# Altium schematic sheet Channel.SchDoc
size A
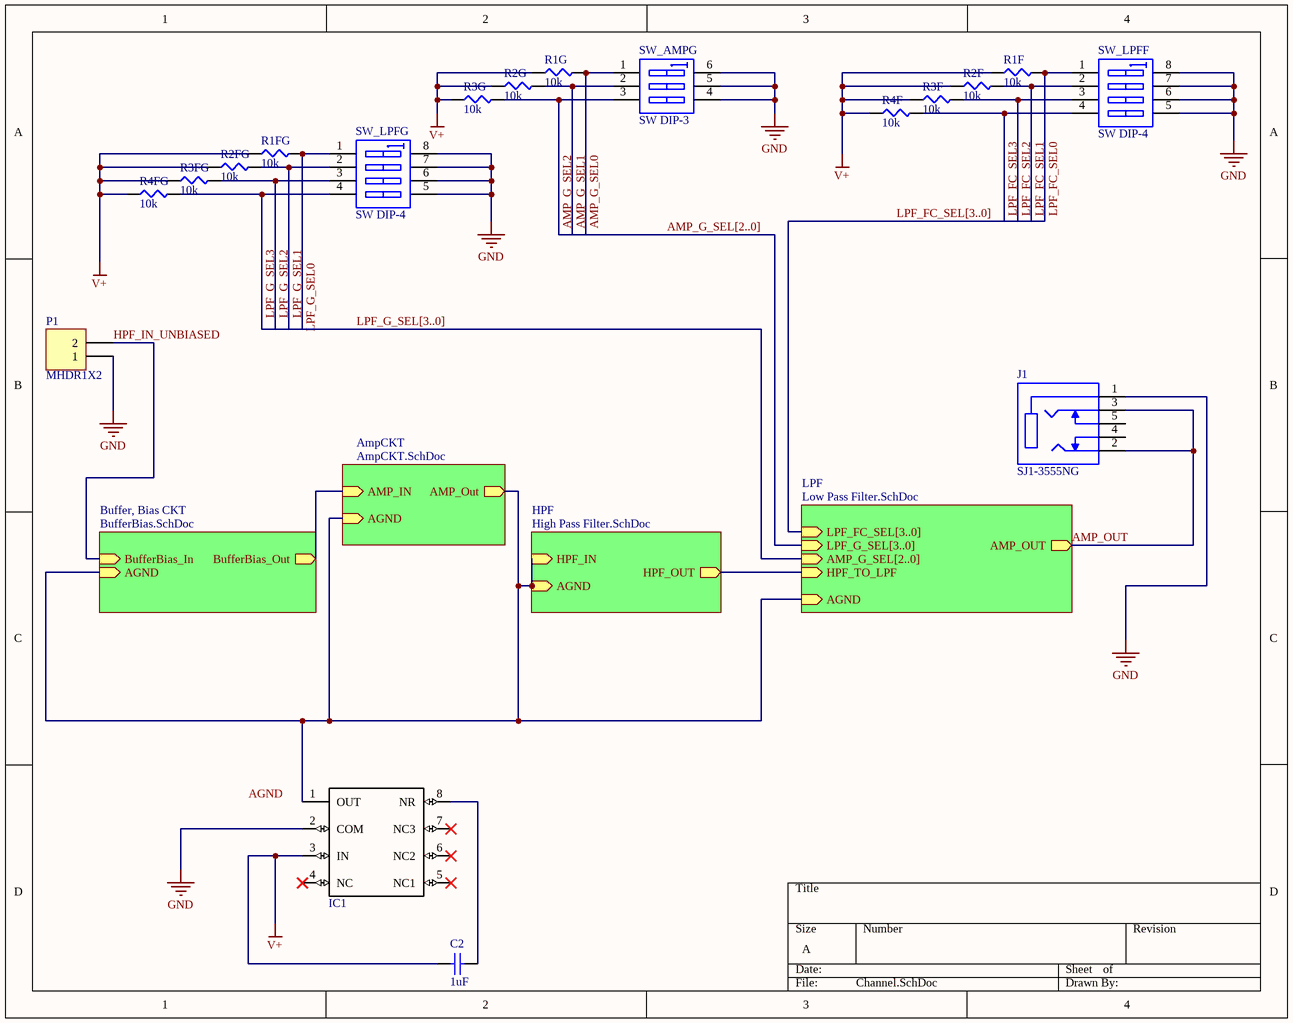
[diagram p0: Channel.SchDoc]

## Parts
C2  value 1uF  [SMD-0805C]  (hidden comment: Cap)
IC1  TLE2426  [SO8_M]  (value not drawn)
J1  SJ1-3555NG  [CUI_SJ1-3555NG]
P1  MHDR1X2  [MHDR1X2]
R1F  10k  [SMD-0805-RES]
R1FG  10k  [SMD-0805-RES]
R1G  10k  [SMD-0805-RES]
R2F  10k  [SMD-0805-RES]
R2FG  10k  [SMD-0805-RES]
R2G  10k  [SMD-0805-RES]
R3F  10k  [SMD-0805-RES]
R3FG  10k  [SMD-0805-RES]
R3G  10k  [SMD-0805-RES]
R4F  10k  [SMD-0805-RES]
R4FG  10k  [SMD-0805-RES]
SW_AMPG  SW DIP-3  [DIP-6]
SW_LPFF  SW DIP-4  [SO8_L]
SW_LPFG  SW DIP-4  [SO8_L]

## Sub-sheets
AmpCKT = AmpCKT.SchDoc: AMP_IN (in), AGND (in), AMP_Out (out)
Buffer, Bias CKT = BufferBias.SchDoc: BufferBias_In (in), AGND (in), BufferBias_Out (out)
HPF = High Pass Filter.SchDoc: HPF_IN (in), AGND (in), HPF_OUT (out)
LPF = Low Pass Filter.SchDoc: LPF_FC_SEL[3..0] (in), LPF_G_SEL[3..0] (in), AMP_G_SEL[2..0] (in), HPF_TO_LPF (in), AMP_OUT (out), AGND (in)

## Nets
GND: IC1.2(COM) J1.1 P1.1 SW_AMPG.4(B3) SW_AMPG.5(B2) SW_AMPG.6(B1) SW_LPFF.5(B4) SW_LPFF.6(B3) SW_LPFF.7(B2) SW_LPFF.8(B1) SW_LPFG.5(B4) SW_LPFG.6(B3) SW_LPFG.7(B2) SW_LPFG.8(B1)
V+: C2.2 IC1.3(IN) R1F.1 R1FG.1 R1G.1 R2F.1 R2FG.1 R2G.1 R3F.1 R3FG.1 R3G.1 R4F.1 R4FG.1
AMP_G_SEL0: R1G.2 SW_AMPG.1(A1)
AMP_G_SEL1: R2G.2 SW_AMPG.2(A2)
AMP_G_SEL2: R3G.2 SW_AMPG.3(A3)
AMP_OUT: J1.2 J1.3 ; sheet LPF/AMP_OUT
HPF_IN_UNBIASED: P1.2 ; sheet Buffer, Bias CKT/BufferBias_In
LPF_FC_SEL0: R1F.2 SW_LPFF.1(A1)
LPF_FC_SEL1: R2F.2 SW_LPFF.2(A2)
LPF_FC_SEL2: R3F.2 SW_LPFF.3(A3)
LPF_FC_SEL3: R4F.2 SW_LPFF.4(A4)
LPF_G_SEL0: R1FG.2 SW_LPFG.1(A1)
LPF_G_SEL1: R2FG.2 SW_LPFG.2(A2)
LPF_G_SEL2: R3FG.2 SW_LPFG.3(A3)
LPF_G_SEL3: R4FG.2 SW_LPFG.4(A4)
NetC2_1: C2.1 IC1.8(NR)
NetIC1_1: IC1.1(OUT) ; sheet LPF/AGND, sheet HPF/HPF_IN, sheet HPF/AGND, sheet Buffer, Bias CKT/AGND, sheet AmpCKT/AGND, sheet AmpCKT/AMP_Out
(unnamed): sheet LPF/HPF_TO_LPF, sheet HPF/HPF_OUT
(unnamed): sheet Buffer, Bias CKT/BufferBias_Out, sheet AmpCKT/AMP_IN

Not connected (* = marked no-connect by the designer): IC1 4(NC)* 5(NC1)* 6(NC2)* 7(NC3)*; J1 4 5

## Buses and harness runs
bus AMP_G_SEL[2..0] = sheet LPF/LPF_G_SEL[3..0]
bus LPF_FC_SEL[3..0] = sheet LPF/LPF_FC_SEL[3..0]
bus LPF_G_SEL[3..0] = sheet LPF/AMP_G_SEL[2..0]

## Notes on the sheet
- AGND

## Library data of the parts
C2 = Cap: Unpolarized Capacitor
IC1 = TLE2426: in signal-conditioning applications utilizing a single power source a reference voltage equal to one-half the supply ...; MF: Texas Instruments; Price: None; SnapEDA_Link: https://www.snapeda.com/parts/TLE2426/Texas%20Instruments/view-part/?ref=snap; MP: TLE2426; Package: SOIC-8 Texas Instruments; Availability: Unavailable; Value: *
J1 = SJ1-3555NG: 3.5 mm, Stereo, Right Angle, Through Hole, Isolated Ground, Kinked Pins, Audio Jack Connector; MF: CUI Devices; Value: *; Price: None; Package: None; DigiKey-Purchase-URL: https://snapeda.com/shop?store=DigiKey&id=231502; Availability: Unavailable; MP: SJ1-3555NG; CUI_purchase_URL: https://www.cuidevices.com/product/interconnect/connectors/audio-connectors/jacks/sj1-355xng-series?utm_source=snapeda.com&utm_medium=referral&utm_campaign=snapedaBOM; SnapEDA_Link: https://www.snapeda.com/parts/SJ1-3555NG/CUI%20Devices/view-part/231502/?ref=snap
P1 = MHDR1X2: Header, 2-Pin; LatestRevisionDate: 17-Jul-2002; LatestRevisionNote: Re-released for DXP Platform.; Publisher: Altium Limited
R1F R1FG R1G R2F R2FG R2G R3F R3FG R3G R4F R4FG = ERJ-6ENF1002V: RES SMD 10K OHM 1% 1/8W 0805; Manufacturer: Panasonic Electronic Components; Factory Stock: 0; Unit Price (USD): 0.00729; @ qty: 1500; Minimum Quantity: 1; Power (Watts): 0.125W, 1/8W; Temperature Coefficient: ±100ppm/°C; Part Number: ERJ-6ENF1002V; Datasheets: http://industrial.panasonic.com/www-cgi/jvcr13pz.cgi?E+PZ+3+AOA0002+ERJ6ENF1002V+7+WW; Image: //media.digikey.com/Renders/Panasonic%20Renders/ERJ-0805%20Pkg.jpg; Digi-Key Part Number: P10.0KCCT-ND; Quantity Available: 3985614; Packaging: Cut Tape (CT); Series: ERJ; Part Status: Active; Value: 10k; Tolerance: ±1%; Composition: Thick Film; Features: Automotive AEC-Q200; Operating Temperature: -55°C ~ 155°C; Package / Case: 0805 (2012 Metric); Supplier Device Package: 0805; Size / Dimension: 0.079" L x 0.049" W (2.00mm x 1.25mm); Height - Seated (Max): 0.028" (0.70mm); Number of Terminations: 2; Failure Rate: -
SW_AMPG = SW DIP-3: DIP Switch, 3 Position, SPST; Published: 24-Mar-1999; LatestRevisionDate: 17-Jul-2002; LatestRevisionNote: Re-released for DXP Platform.; PackageReference: DIP-6; Publisher: Altium Limited; Code_JEDEC: MO-001-AM
SW_LPFF SW_LPFG = SW DIP-4: DIP Switch, 4 Position, SPST; Published: 24-Mar-1999; LatestRevisionDate: 29-May-2009; LatestRevisionNote: IPC-7351 Footprint Added.; PackageVersion: Dec-2002; PackageReference: SO8; Publisher: Altium Limited; PackageDescription: 8-Pin Small Outline Integrated Circuit 1.27 mm Pitch; Code_JEDEC: MS-012-AA; Code_IPC: SOIC127P600-8